# EAGLE schematic MakerSchematic (EAGLE 9.7.0)
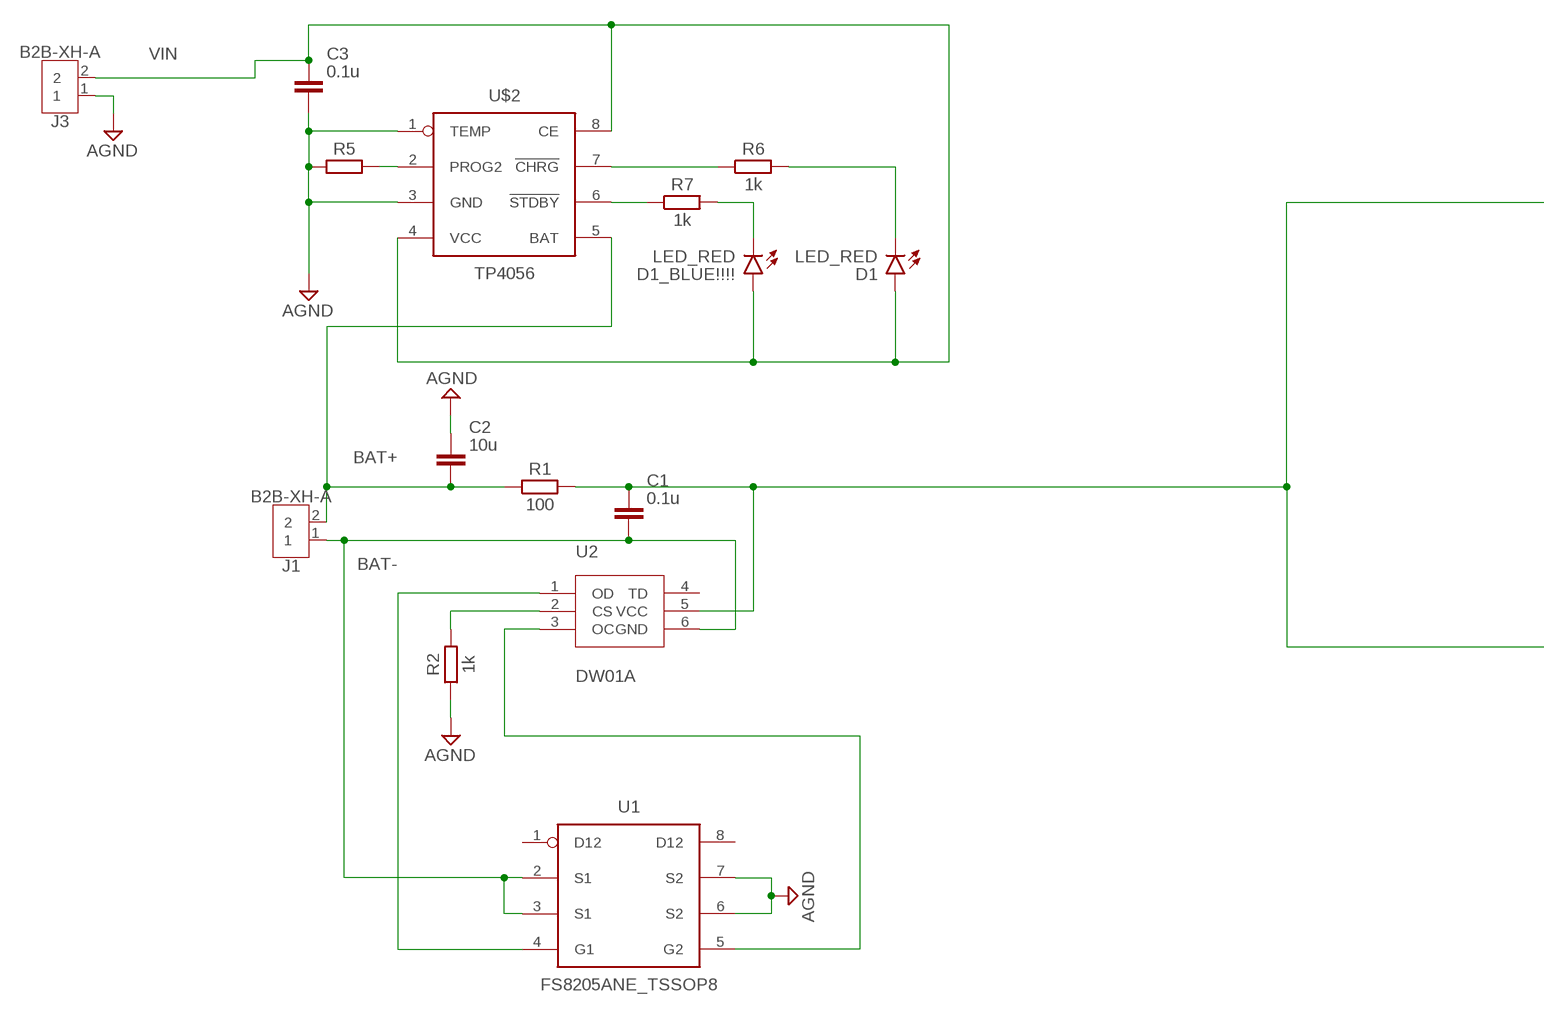
[diagram p0: schematic, sheet 1, part 1 of 2]
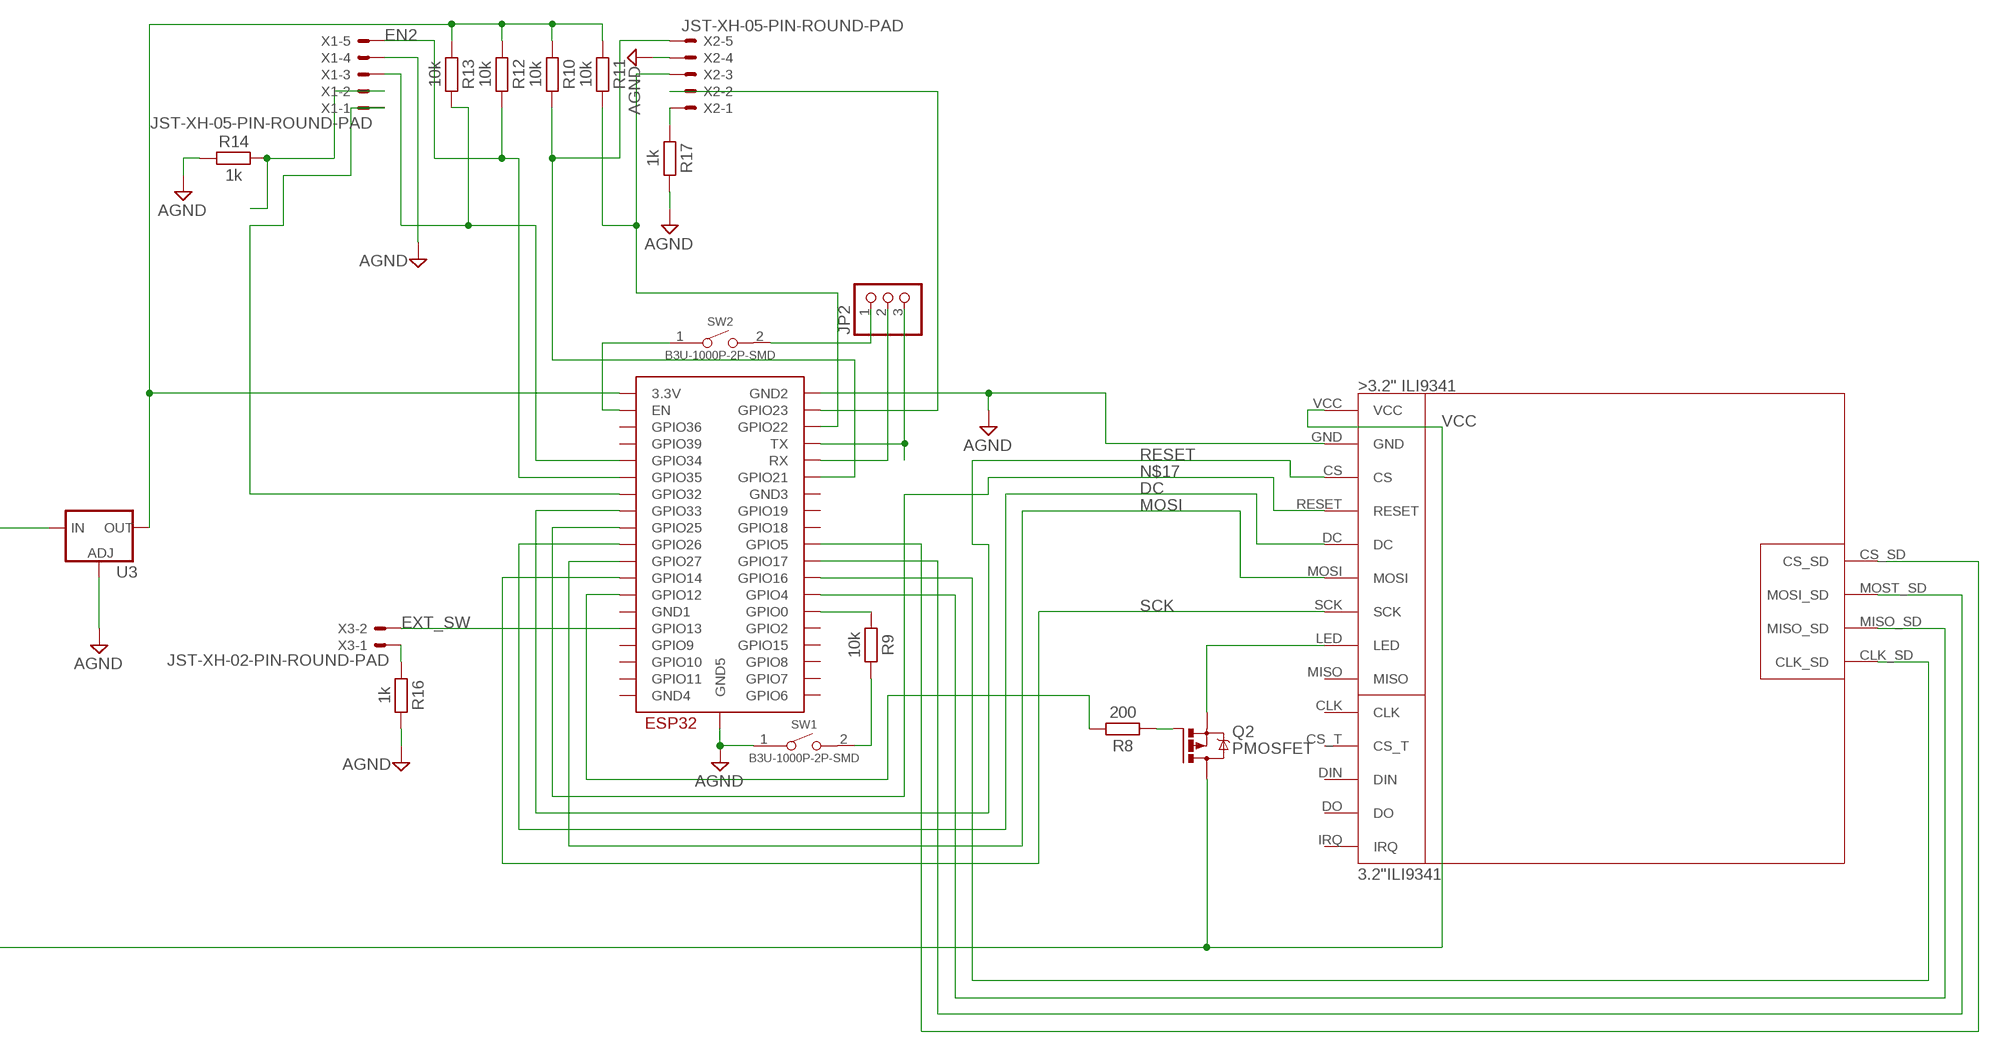
[diagram p1: schematic, sheet 1, part 2 of 2]

## Parts
C1  0.1u  C_CHIP-0603(1608-METRIC)  [CAPC1608X85]
C2  10u  C_CHIP-0603(1608-METRIC)  [CAPC1608X85]
C3  0.1u  C_CHIP-0603(1608-METRIC)  [CAPC1608X85]
D1  LED_RED  CHIP-FLAT-R_0805  [LEDC2012X110N_FLAT-R]
D1_BLUE!!!!  LED_RED  CHIP-FLAT-R_0805  [LEDC2012X110N_FLAT-R]
J1  B2B-XH-A  [B2B-XH-A]
J3  B2B-XH-A  [B2B-XH-A]
JP2  PINHD-1X3/90  [1X03/90]
Q2  PMOSFET  PMOSFET_SOT23-GSD  [SOT23]
R1  100  R_CHIP-0805(2012-METRIC)  [RESC2012X65]
R2  1k  R_CHIP-0603(1608-METRIC)  [RESC1608X60]
R5  R_CHIP-0603(1608-METRIC)  [RESC1608X60]
R6  1k  R_CHIP-0603(1608-METRIC)  [RESC1608X60]
R7  1k  R_CHIP-0603(1608-METRIC)  [RESC1608X60]
R8  200  R_CHIP-0805(2012-METRIC)  [RESC2012X65]
R9  10k  R_CHIP-0603(1608-METRIC)  [RESC1608X60]
R10  10k  R_CHIP-0603(1608-METRIC)  [RESC1608X60]
R11  10k  R_CHIP-0603(1608-METRIC)  [RESC1608X60]
R12  10k  R_CHIP-0603(1608-METRIC)  [RESC1608X60]
R13  10k  R_CHIP-0603(1608-METRIC)  [RESC1608X60]
R14  1k  R_CHIP-0603(1608-METRIC)  [RESC1608X60]
R16  1k  R_CHIP-0603(1608-METRIC)  [RESC1608X60]
R17  1k  R_CHIP-0603(1608-METRIC)  [RESC1608X60]
SW1  B3U-1000P-2P-SMD  SMD-BUTTON(2P-3.0X2.5X1.2+0.4MM)-B3U-1000P-2P-SMD  [SW2-2.6-3.0X2.5X1.2+0.4MM]
SW2  B3U-1000P-2P-SMD  SMD-BUTTON(2P-3.0X2.5X1.2+0.4MM)-B3U-1000P-2P-SMD  [SW2-2.6-3.0X2.5X1.2+0.4MM]
U1  FS8205ANE_TSSOP8  [SOP65P640X120-8]
U2  DW01A  [DW01A]
U3  V_REG_LM1117SOT223  [SOT223]
U$1  ESP32-WROOM  [ESP32-WROOM]
U$2  TP4056  [SOIC127P601X152-8N]
U$3  3.2"ILI9341  [3.2"ILI9341]
X1  JST-XH-05-PIN-ROUND-PAD  [JST-XH-05-PACKAGE-ROUND-PAD]
X2  JST-XH-05-PIN-ROUND-PAD  [JST-XH-05-PACKAGE-ROUND-PAD]
X3  JST-XH-02-PIN-ROUND-PAD  [JST-XH-02-PACKAGE-ROUND-PAD]

## Nets
AGND: C2.1 C3.2 J3.1 R2.1 R5.1 R14.1 R16.2 R17.2 SW1.1 U1.6(S2) U1.7(S2) U3.1(ADJ) U$1.GND2 U$1.GND5 U$2.1(TEMP) U$2.3(GND) U$3.GND X1.4 X2.4
BAT+: C2.2 J1.2 R1.1 U$2.5(BAT)
BAT-: C1.2 J1.1 U1.2(S1) U1.3(S1) U2.6(GND)
DC: U$1.IO26(GPIO26) U$3.DC
EN2: R12.2 U$1.IO35(GPIO35) X1.5
EXT_SW: U$1.IO13(GPIO13) X3.2
MOSI: U$1.IO27(GPIO27) U$3.MOSI
N$1: R10.1 R11.1 R12.1 R13.1 U3.2(OUT) U3.4(OUT) U$1.3V3(3.3V)
N$2: U1.4(G1) U2.1(OD)
N$3: U1.5(G2) U2.3(OC)
N$4: R2.2 U2.2(CS)
N$7: R6.1 U$2.7(!CHRG)
N$8: R5.2 U$2.2(PROG2)
N$9: D1_BLUE!!!!.C R7.2
N$10: R7.1 U$2.6(!STDBY)
N$11: D1.C R6.2
N$12: R9.1 U$1.IO0(GPIO0)
N$13: JP2.2 U$1.RX
N$14: JP2.3 U$1.TX
N$15: SW2.1 U$1.EN
N$16: R8.2 U$1.IO12(GPIO12)
N$17: U$1.IO25(GPIO25) U$3.RESET
N$18: R17.1 X2.1
N$19: Q2.1(G) R8.1
N$20: JP2.1 SW2.2
N$21: R10.2 U$1.IO21(GPIO21) X2.5
N$22: R13.2 U$1.IO34(GPIO34) X1.3
N$24: U$1.IO23(GPIO23) X2.2
N$25: U$1.IO32(GPIO32) X1.1
N$27: R9.2 SW1.2
N$28: Q2.2(S) U$3.LED
N$29: U$1.IO17(GPIO17) U$3.MOST_SD(MOSI_SD)
N$31: U$1.IO16(GPIO16) U$3.CLK_SD
N$33: R14.2 X1.2
N$35: R16.1 X3.1
N$37: U$1.IO4(GPIO4) U$3.MISO_SD
N$39: U$1.IO5(GPIO5) U$3.CS_SD
RESET: U$1.IO33(GPIO33) U$3.CS
SCK: U$1.IO14(GPIO14) U$3.SCK
VCC: C1.1 Q2.3(D) R1.2 U2.5(VCC) U3.3(IN) U$3.VCC
VIN: C3.1 D1.A D1_BLUE!!!!.A J3.2 U$2.4(VCC) U$2.8(CE)
YOURMOM: R11.2 U$1.IO22(GPIO22) X2.3
Unconnected: U1.1(D12) U2.4(TD) U$1.CLK(GPIO6) U$1.CMD(GPIO11) U$1.GND1 U$1.GND3 U$1.GND4 U$1.IO2(GPIO2) U$1.IO15(GPIO15) U$1.IO18(GPIO18) U$1.IO19(GPIO19) U$1.SD0(GPIO7) U$1.SD1(GPIO8) U$1.SD2(GPIO9) U$1.SD3(GPIO10) U$1.SENSOR_VN(GPIO39) U$1.SENSOR_VP(GPIO36) U$3.CLK U$3.CS_T U$3.DIN U$3.DO U$3.IRQ U$3.MISO

## Power pins joined to a net without a drawn wire
D12: U1.8(D12)

## Library data of the parts
C1-C3 = Capacitor:C: Capacitor - Generic; CATEGORY: Capacitor
D1 D1_BLUE!!!! = LED:CHIP-FLAT-R; CATEGORY: LED; COLOR: RED; DESCRIPTION: CHIP LED FLAT; SUB-CATEGORY: CHIP; TYPE: FLAT_TOP
J1 J3 = Connector:B2B-XH-A: XH Connector Top Entry - 2POS Details see: Datasheet <http://www.jst-mfg.com/product/pdf/eng/eXH.pdf>; CATEGORY: Header; DESCRIPTION: Connector Header Through Hole 2 position 0.098" (2.50mm); MANUFACTURER: JST Sales America Inc.; MPN: B2B-XH-A(LF)(SN); OPERATING_TEMPERATURE: -25°C ~ 85°C; PART_STATUS: ACTIVE; PITCH: 0.098" (2.50mm); ROHS_COMPLIANCE: ROHS3 Compliant; SERIES: XH; SUB_CATEGORY: Rectangular Connectors; TYPE: Header, Male Pin, Board to Cable/Wire, Through Hole
JP2 = pinhead:PINHD-1X3: PIN HEADER
Q2 = Transistor:PMOSFET: P-Channel MOSFET - Generic; CATEGORY: Transistor; SUB-CATEGORY: MOSFET; TYPE: P-Channel
R1 R2 R5-R14 R16 R17 = Resistor:R: Resistor Fixed - Generic; CATEGORY: Resistor; SUB-CATEGORY: Fixed
SW1 SW2 = Fidget_Spinner:SMD-BUTTON(2P-3.0X2.5X1.2+0.4MM): 311020047; MPN: B3U-1000P-2P-SMD
U1 = Library:FS8205A: TIMER 555 General purpose precision timers NE555 : Texas Datasheet <http://www.ti.com/general/docs/suppproductinfo.tsp?distId=10&gotoUrl=http%3A%2F%2Fwww.ti.com%2Flit%2Fgpn%2Fne555>, Diodes Incorporated Datasheet <https://www.diodes.com/assets/Datasheets/NE555_SA555_NA555.pdf> LM555 Datasheet <http://www.ti.com/general/docs/suppproductinfo.tsp?distId=10&gotoUrl=http%3A%2F%2Fwww.ti.com%2Flit%2Fgpn%2Flm555> LMC555 Datasheet <http://www.ti.com/general/docs/suppproductinfo.tsp?distId=10&gotoUrl=http%3A%2F%2Fwww.ti.com%2Flit%2Fgpn%2Flmc555> ICM7555 : Maxim Integrated Datasheet <https://datasheets.maximintegrated.com/en/ds/ICM7555-ICM7556.pdf>, Renesas Electronics America Inc Datasheet <https://www.renesas.com/en-us/www/doc/datasheet/icm7555-56.pdf>; CATEGORY: IC_Clock-Timing; CURRENT-SUPPLY: 10mA; DESCRIPTION: IC OSC SGL TIMER 100KHZ 8TSSOP; FREQUENCY: 100kHz; MANUFACTURER: Texas Instruments; MPN: NE555PW; OPERATING_TEMP: 0°C to 70°C; PART_STATUS: Active; ROHS_COMPLIANT: ROHS3 Compliant; SUB-CATEGORY: Timer
U2 = Library1:DW01A
U3 = SparkFun-IC-Power:V_REG_LM1117: Voltage Regulator LM1117 Standard adjustable voltage regulator but in SMD form. Spark Fun Electronics SKU : COM-00595; PROD_ID: VREG-08170
U$1 = Library:ESP32-WROOM
U$2 = TP4056:TP4056
U$3 = ILI9341:3.2"ILI9341
X1 X2 = Rembrandt Electronics - JST XH Connectors v1-0:JST-XH-05-PIN: JST XH Connector 2 Pin Wire to board connector. Pitch: 2,54 mm, (0.100") Number of pins: 5 Created by Rembrandt Electronics www.rembrandtelectronics.com
X3 = Rembrandt Electronics - JST XH Connectors v1-0:JST-XH-02-PIN: JST XH Connector 2 Pin Wire to board connector. Pitch: 2,54 mm, (0.100") Number of pins: 2 Created by Rembrandt Electronics www.rembrandtelectronics.com